# Altium schematic sheet SYNOPTIQUE.SchDoc: Carte mère embarquée - Synoptique
size A3; Author: B Labbe; CompanyName: Ouffteam; DrawnBy: B Labbe; Engineer: B Labbe; Organization: Ouffteam; Address1: L3, 12a Rodborough Rd; Address2: Frenchs Forest; Address3: NSW; Address4: Australia 2086; Revision: A; SheetNumber: 1; SheetTotal: 6; DocumentName: Carte mère embarquée - Synoptique
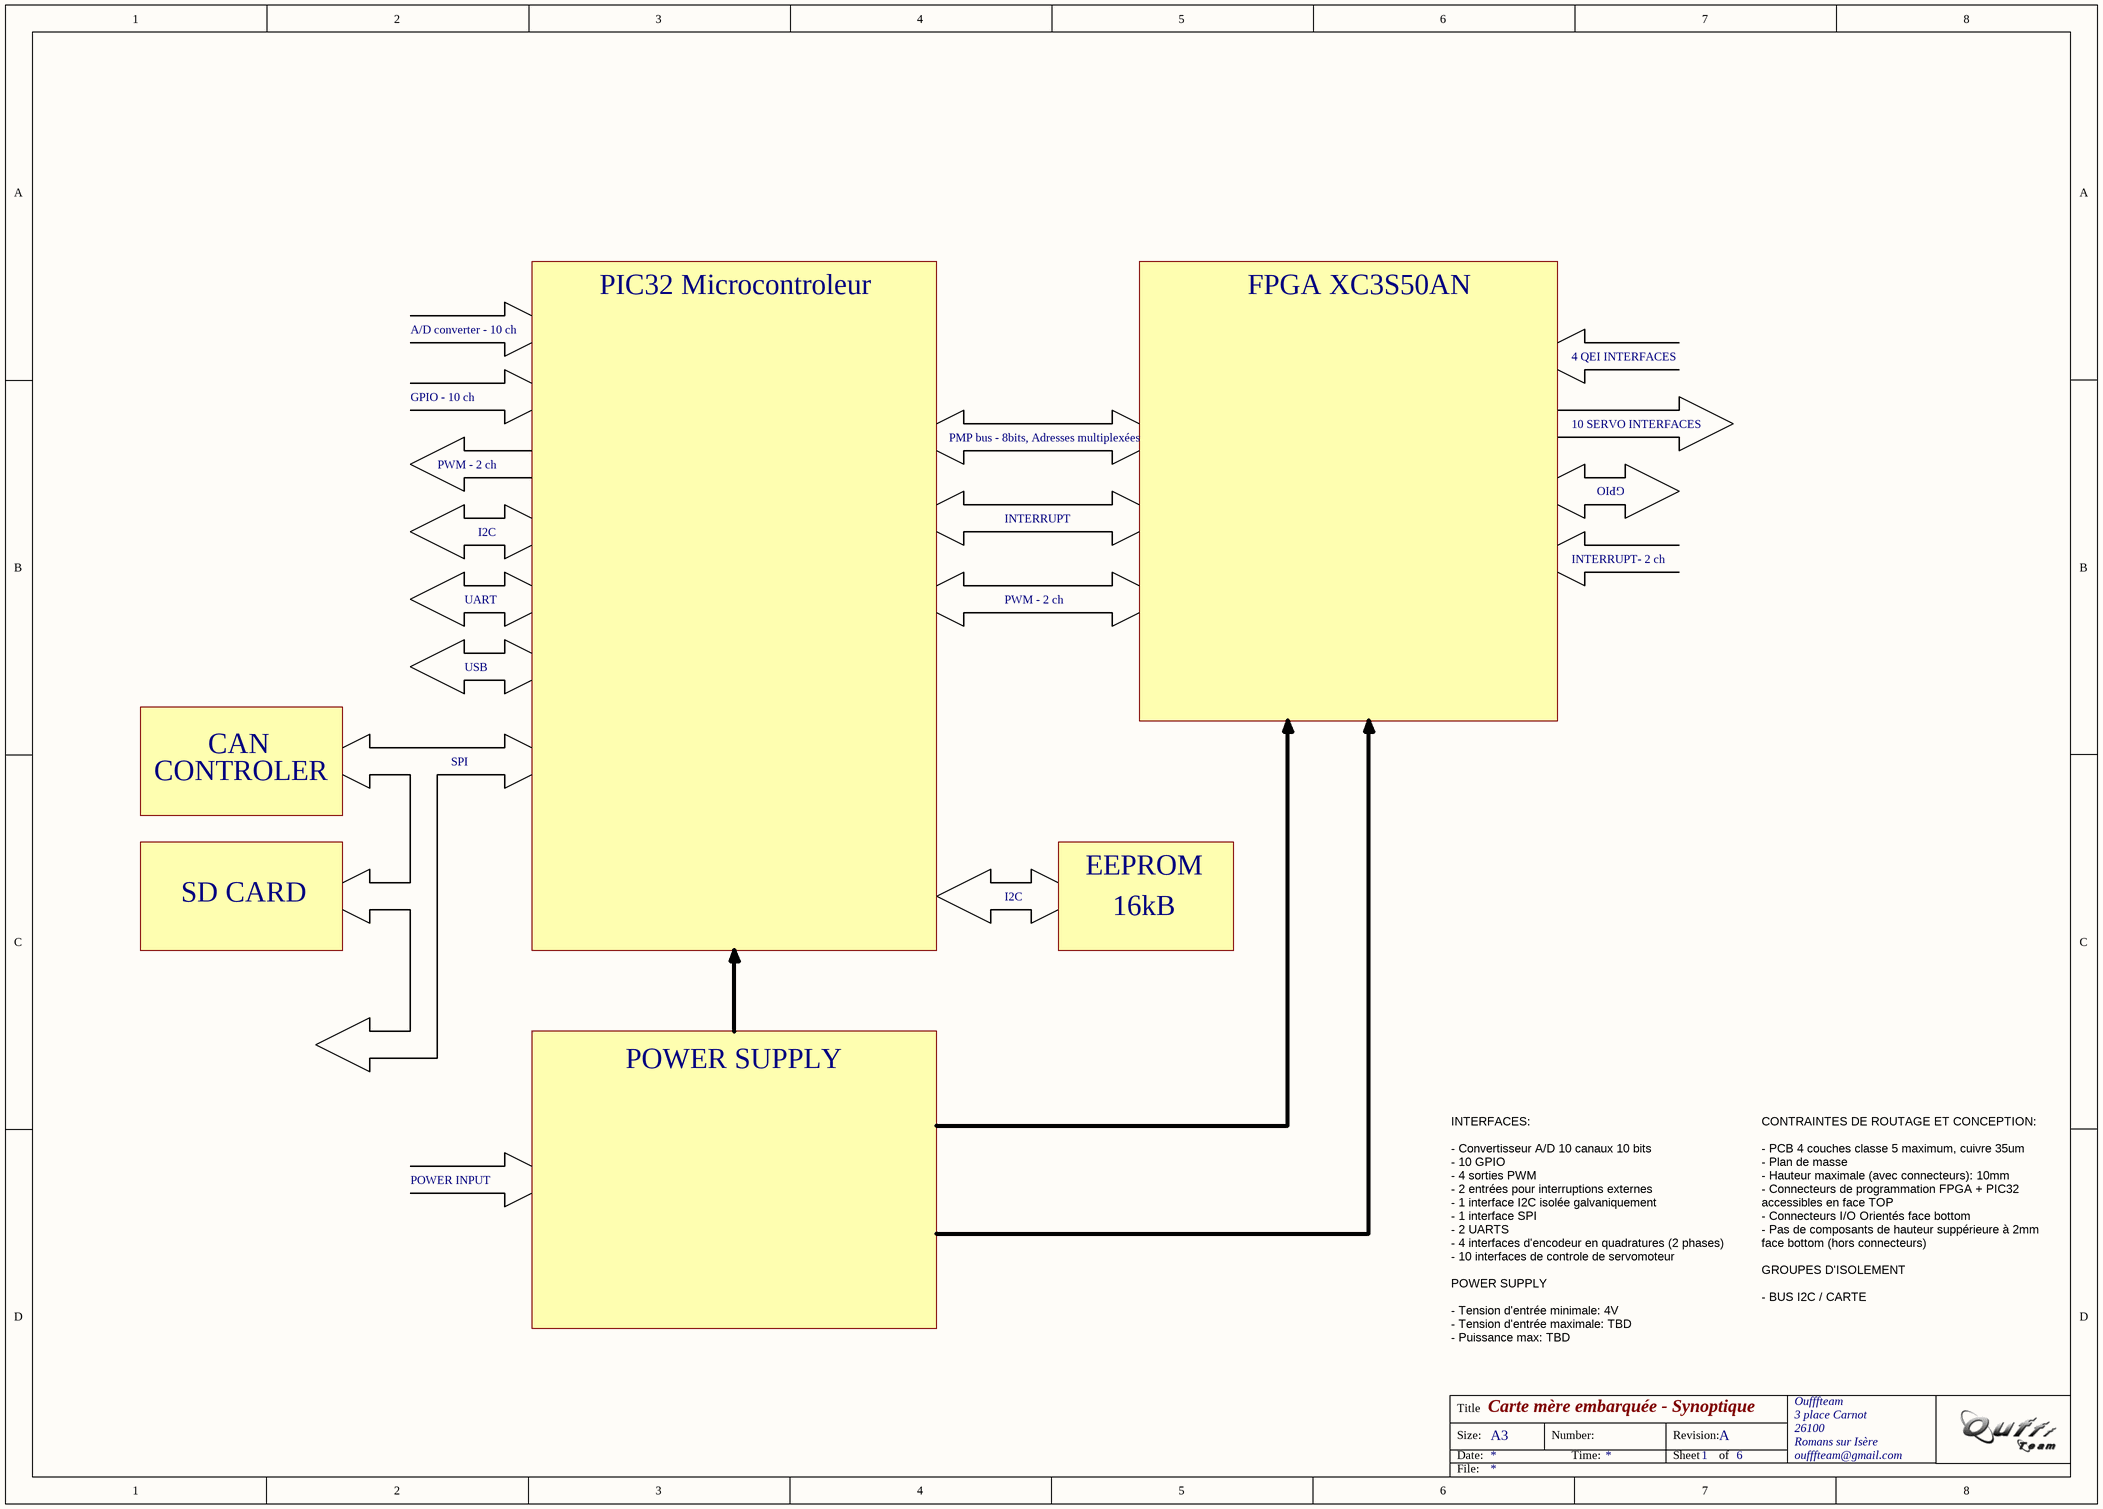
[diagram p0: SYNOPTIQUE.SchDoc]

## Notes on the sheet
- PIC32 Microcontroleur
- FPGA XC3S50AN
- A/D converter - 10 ch
- 4 QEI INTERFACES
- GPIO - 10 ch
- PMP bus - 8bits, Adresses multiplexées
- 10 SERVO INTERFACES
- PWM - 2 ch
- INTERRUPT
- GPIO
- I2C
- INTERRUPT- 2 ch
- UART
- USB
- CONTROLER
- CAN
- SPI
- SD CARD
- EEPROM
- 16kB
- POWER SUPPLY
- POWER INPUT
- INTERFACES:
  - Convertisseur A/D 10 canaux 10 bits
  - 10 GPIO
  - 4 sorties PWM
  - 2 entrées pour interruptions externes
  - 1 interface I2C isolée galvaniquement
  - 1 interface SPI
  - 2 UARTS
  - 4 interfaces d'encodeur en quadratures (2 phases)
  - 10 interfaces de controle de servomoteur
  POWER SUPPLY
  - Tension d'entrée minimale: 4V
  - Tension d'entrée maximale: TBD
  - Puissance max: TBD
- CONTRAINTES DE ROUTAGE ET CONCEPTION:
  - PCB 4 couches classe 5 maximum, cuivre 35um
  - Plan de masse
  - Hauteur maximale (avec connecteurs): 10mm
  - Connecteurs de programmation FPGA + PIC32 accessibles en face TOP
  - Connecteurs I/O Orientés face bottom
  - Pas de composants de hauteur suppérieure à 2mm face bottom (hors connecteurs)
  GROUPES D'ISOLEMENT
  - BUS I2C / CARTE
- Title
- Size:
- Date:
- A3
- Number:
- Time:
- Revision:
- Sheet
- of
- Oufffteam
- 3 place Carnot
- 26100
- Romans sur Isère
- oufffteam@gmail.com
- File: